# Altium project Dali-v01.PrjPcb
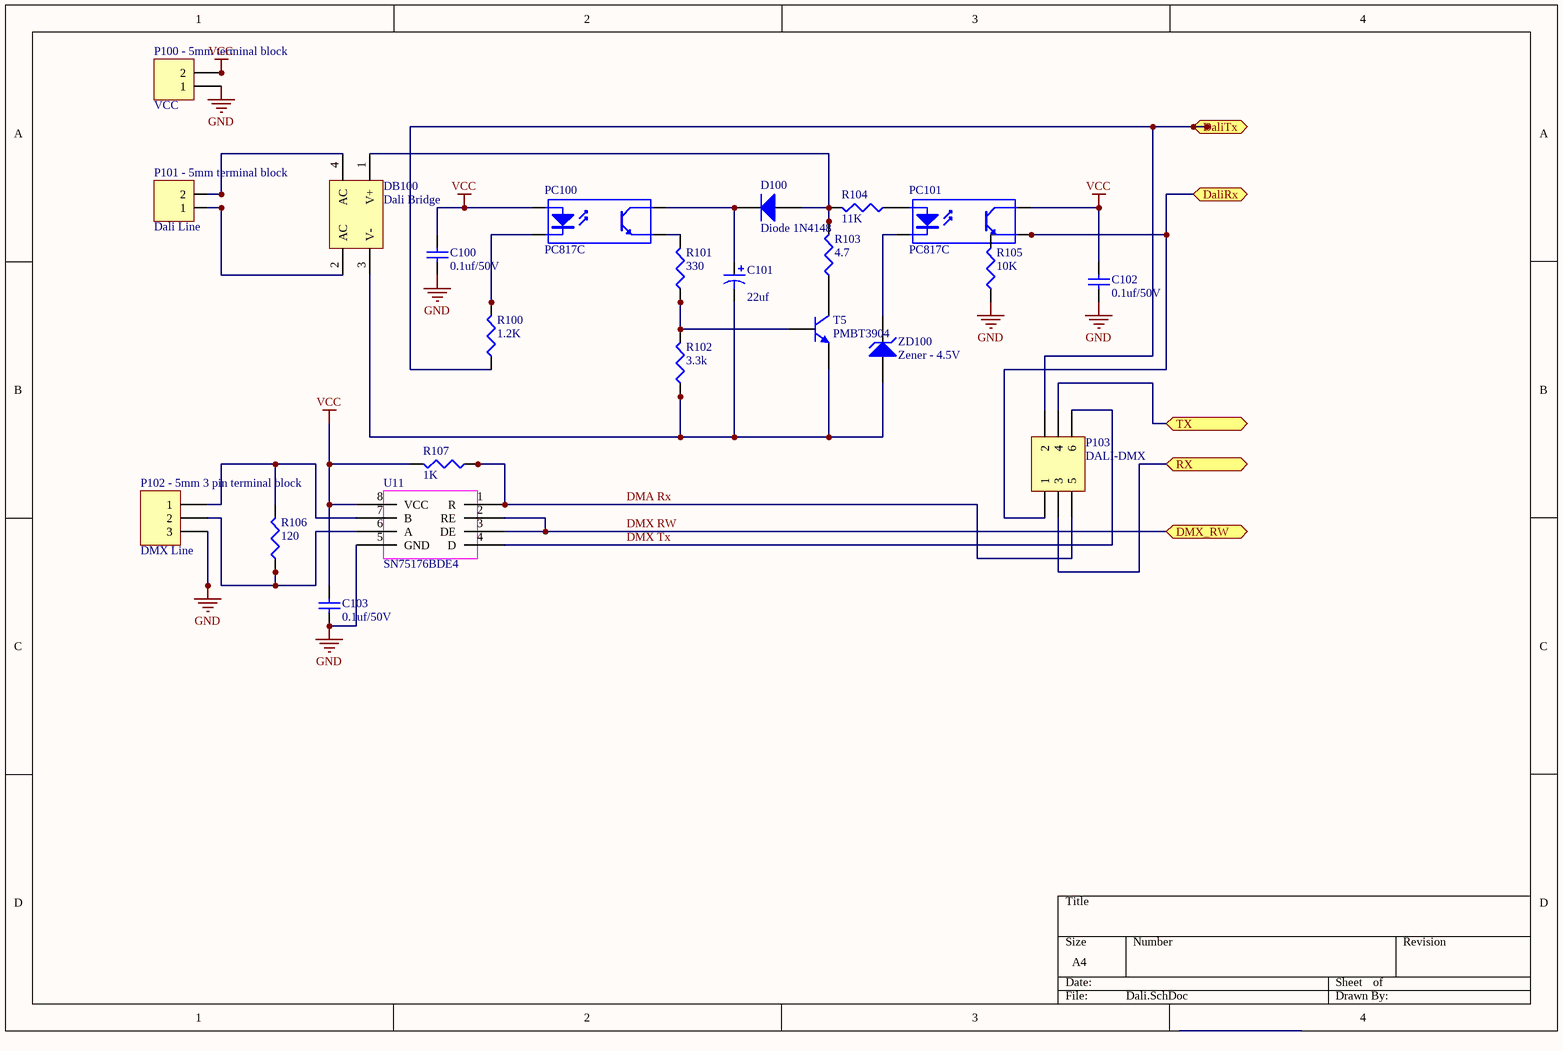
[diagram p0: Dali.SchDoc]
3 sheets, 82 parts. Net scope: flat (ports and power ports of the same name join across sheets).
Sheets:
  Dali.SchDoc
  Micro.SchDoc
  LEDDriver.SchDoc

## Sheet Dali.SchDoc
size A4

### Parts
C100  0.1uf/50V  [CC3225-1210]
C101  value 22uf  [CAPPR2.5-6.3x5]  (hidden comment: 22uf/16v)
C102  0.1uf/50V  [CC3225-1210]
C103  0.1uf/50V  [CC3225-1210]
D100  Diode 1N4148  [DO-35]
DB100  Dali Bridge  [SDIP]
P100_-_5mm_terminal_block  VCC  [HDR1X2]
P101_-_5mm_terminal_block  Dali Line  [HDR1X2]
P102_-_5mm_3_pin_terminal_block  DMX Line  [HDR1X3]
P103  DALI-DMX  [HDR2X3]
PC100  PC817C  [DIP-4]
PC101  PC817C  [DIP-4]
R100  value 1.2K  [CR2012-0805]  (hidden comment: CR2012-0805)
R101  value 330  [CR2012-0805]  (hidden comment: CR2012-0805)
R102  value 3.3k  [CR2012-0805]  (hidden comment: CR2012-0805)
R103  value 4.7  [CR2012-0805]  (hidden comment: CR2012-0805)
R104  value 11K  [CR2012-0805]  (hidden comment: CR2012-0805)
R105  value 10K  [CR2012-0805]  (hidden comment: CR2012-0805)
R106  value 120  [CR2012-0805]  (hidden comment: CR2012-0805)
R107  value 1K  [CR2012-0805]  (hidden comment: CR2012-0805)
T5  PMBT3904  [SOT23_N]
U11  SN75176BDE4  [8-SOIC (0.154", 3.90mm Width)]
ZD100  Zener - 4.5V  [DIODE-0.7]

### Ports
DaliRx, DaliTx, DMX_RW, RX, TX

### Nets
GND: C100.1 C102.1 C103.1 P100_-_5mm_terminal_block.1 P102_-_5mm_3_pin_terminal_block.3 R105.1 U11.5(GND)
VCC: C100.2 C102.2 C103.2 P100_-_5mm_terminal_block.2 PC100.1(A) PC101.4(C) R107.2 U11.8(VCC)
DMA Rx: P103.5 R107.1 U11.1(R)
DMX RW: U11.2(RE) U11.3(DE) ; port DMX_RW
DMX Tx: P103.6 U11.4(D)
NetC101_1: C101.1 D100.2(K) PC100.4(C)
NetC101_2: C101.2 DB100.3(V-) R102.1 T5.2(E) ZD100.1(A)
NetD100_1: D100.1(A) DB100.1(V+) R103.2 R104.2
NetDB100_2: DB100.2(AC) P101_-_5mm_terminal_block.1
NetDB100_4: DB100.4(AC) P101_-_5mm_terminal_block.2
NetP102_-_5mm_3_pin_terminal_block_1: P102_-_5mm_3_pin_terminal_block.1 R106.2 U11.7(B)
NetP102_-_5mm_3_pin_terminal_block_2: P102_-_5mm_3_pin_terminal_block.2 R106.1 U11.6(A)
NetP103_1: P103.1 PC101.3(E) R105.2 ; port DaliRx
NetP103_2: P103.2 R100.1 ; port DaliTx
NetP103_3: P103.3 ; port RX
NetP103_4: P103.4 ; port TX
NetPC100_2: PC100.2(K) R100.2
NetPC100_3: PC100.3(E) R101.2
NetPC101_1: PC101.1(A) R104.1
NetPC101_2: PC101.2(K) ZD100.2(K)
NetR101_1: R101.1 R102.2 T5.1(B)
NetR103_1: R103.1 T5.3(C)

### Library data of the parts
C100 C102 C103 = Cap: Capacitor; Value: 0.1uf; Published: 8-Jun-2000; LatestRevisionDate: 17-Jul-2002; LatestRevisionNote: Re-released for DXP Platform.; PackageReference: RAD-0.3; Publisher: Altium Limited; PackageDescription: Radial Cap, Thru-Hole; 2 Leads; 0.3 in Pin Spacing
C101 = Cap Pol1: Polarized Capacitor (Radial); Published: 8-Jun-2000; LatestRevisionDate: 17-Jul-2002; LatestRevisionNote: Re-released for DXP Platform.; PackageReference: RB7.6-15; Publisher: Altium Limited; PackageDescription: Polarized Capacitor (Radial); 2 Leads
D100 = Diode 1N4148: High Conductance Fast Diode; Published: 8-Jun-2000; LatestRevisionDate: 17-Jul-2002; LatestRevisionNote: Re-released for DXP Platform.; DatasheetVersion: 1997; PackageReference: DO-35; Publisher: Altium Limited; PackageDescription: Diode, Axial; Body 3.8 x 1.9 mm (LxDia. max), Lead Dia. 0.53 mm (max); Code_JEDEC: DO-204-AH; ComponentLink1Description: Manufacturer Link; ComponentLink1URL: http://www.fairchildsemi.com/; ComponentLink2Description: Datasheet; ComponentLink2URL: http://www.fairchildsemi.com/ds/1N%2F1N4148.pdf
DB100 = Bridge2: Diode Bridge; Published: 24-Mar-1999; LatestRevisionDate: 17-Jul-2002; LatestRevisionNote: Re-released for DXP Platform.; PackageReference: D-46_6A; Publisher: Altium Limited; PackageDescription: Bridge Rectifier; 4 Terminals; Body 16.8 x 16.8 mm (typ); Pitch 10.67 mm
P100_-_5mm_terminal_block P101_-_5mm_terminal_block = Header 2: Header, 2-Pin; LatestRevisionDate: 17-Jul-2002; LatestRevisionNote: Re-released for DXP Platform.; Publisher: Altium Limited
P102_-_5mm_3_pin_terminal_block = Header 3: Header, 3-Pin; LatestRevisionDate: 17-Jul-2002; LatestRevisionNote: Re-released for DXP Platform.; Publisher: Altium Limited
P103 = Header 3X2: Header, 3-Pin, Dual row; LatestRevisionDate: 17-Jul-2002; LatestRevisionNote: Re-released for DXP Platform.; Publisher: Altium Limited
PC100 PC101 = Optoisolator1: 4-Pin Phototransistor Optocoupler; Published: 24-Mar-1999; LatestRevisionDate: 04-Mar-2005; LatestRevisionNote: Sch pins 3 & 4 Swapped.; DatasheetVersion: Nov-2003; PackageReference: DIP-4; Publisher: Altium Limited
R100-R107 = Res3: Resistor; Published: 8-Jun-2000; LatestRevisionDate: 29-May-2009; LatestRevisionNote: IPC-7351 Footprint Added.; PackageReference: CR2012-0805; Publisher: Altium Limited; PackageDescription: Chip Resistor
T5 = PMBT3904: NPN Switching Transistor; Published: 17-Sep-2003; LatestRevisionDate: 12-Dec-2006; LatestRevisionNote: IPC-7351 Footprint Added.; DatasheetVersion: 27-Apr-1999; PackageVersion: May-1999; PackageReference: SOT23; Publisher: Altium Limited; PackageDescription: 3-Pin SOT-23 Package 0.95 mm Pitch, 2.3 mm Lead Span; ComponentLink1Description: Manufacturer Link; ComponentLink1URL: http://www.semiconductors.philips.com/; ComponentLink2Description: Datasheet; ComponentLink2URL: http://www.semiconductors.philips.com/acrobat/datasheets/PMBT3904_4.pdf
U11 = Component_1
ZD100 = D Zener: Zener Diode; Published: 8-Jun-2000; LatestRevisionDate: 17-Jul-2002; LatestRevisionNote: Re-released for DXP Platform.; PackageReference: DIODE-0.7; Publisher: Altium Limited; PackageDescription: Diode, Thru-Hole; 2 Leads; 0.7 in Pin Spacing

## Sheet Micro.SchDoc
size A4
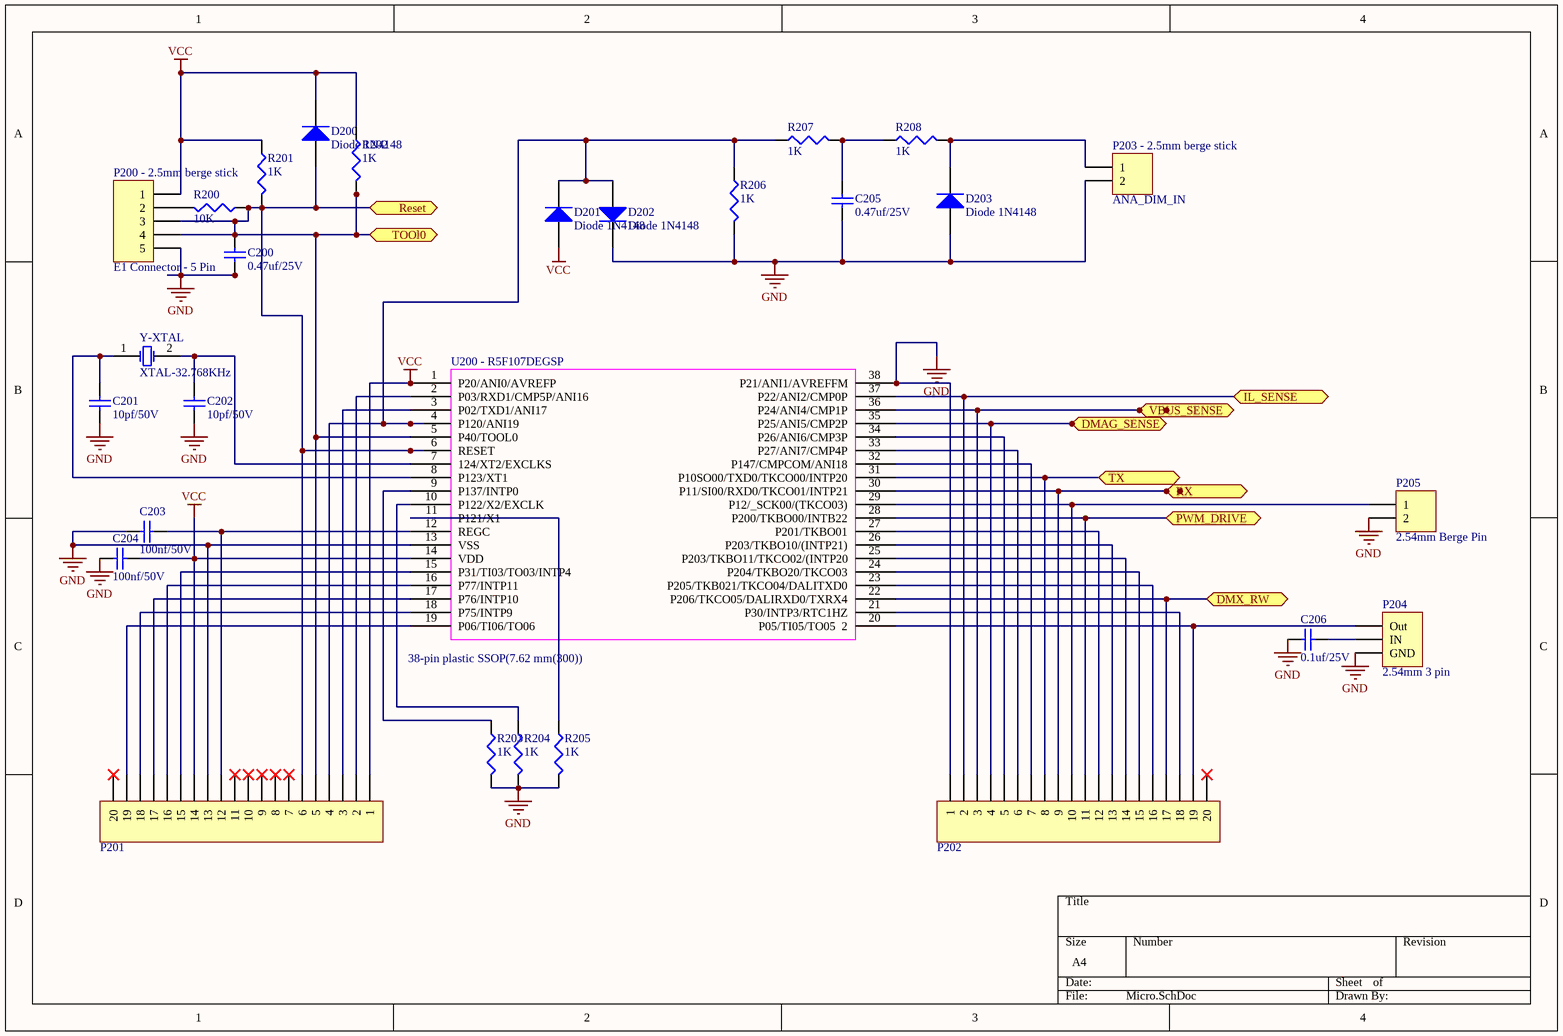
[diagram p1: Micro.SchDoc]

### Parts
C200  0.47uf/25V  [CC3225-1210]
C201  10pf/50V  [CC3225-1210]
C202  10pf/50V  [CC3225-1210]
C203  100nf/50V  [CC3225-1210]
C204  100nf/50V  [CC3225-1210]
C205  0.47uf/25V  [CC3225-1210]
C206  0.1uf/25V  [CC3225-1210]
D200  Diode 1N4148  [DO-35]
D201  Diode 1N4148  [DO-35]
D202  Diode 1N4148  [DO-35]
D203  Diode 1N4148  [DO-35]
P200_-_2.5mm_berge_stick  E1 Connector - 5 Pin  [HDR1X5]
P201  20 pin 2.5 mm berge stick  [HDR1X20]  (value not drawn)
P202  20 pin 2.5mm berge stick  [HDR1X20]  (value not drawn)
P203_-_2.5mm_berge_stick  ANA_DIM_IN  [HDR1X2]
P204  2.54mm 3 pin  [HDR1X3]
P205  2.54mm Berge Pin  [HDR1X2]
R200  value 10K  [CR2012-0805]  (hidden comment: CR2012-0805)
R201  value 1K  [CR2012-0805]  (hidden comment: CR2012-0805)
R202  value 1K  [CR2012-0805]  (hidden comment: CR2012-0805)
R203  value 1K  [CR2012-0805]  (hidden comment: CR2012-0805)
R204  value 1K  [CR2012-0805]  (hidden comment: CR2012-0805)
R205  value 1K  [CR2012-0805]  (hidden comment: CR2012-0805)
R206  value 1K  [CR2012-0805]  (hidden comment: CR2012-0805)
R207  value 1K  [CR2012-0805]  (hidden comment: CR2012-0805)
R208  value 1K  [CR2012-0805]  (hidden comment: CR2012-0805)
U200_-_R5F107DEGSP  38-pin plastic SSOP(7.62 mm(300))
Y-XTAL  XTAL-32.768KHz  [XI-11.1X4.68X3.51mm]

### Ports
DMAG_SENSE, DMX_RW, IL_SENSE, PWM_DRIVE, Reset, RX, TOOl0, TX, VBUS_SENSE

### Nets
GND: C200.1 C201.1 C202.1 C203.2 C204.2 C205.1 C206.2 D202.2(K) D203.1(A) P200_-_2.5mm_berge_stick.5 P201.13 P202.1 P203_-_2.5mm_berge_stick.2 P204.3(GND) P205.2 R203.2 R204.2 R205.2 R206.2 U200_-_R5F107DEGSP.13(VSS) U200_-_R5F107DEGSP.38(P21/ANI1/AVREFFM)
VCC: C204.1 D200.2(K) D201.1(A) P200_-_2.5mm_berge_stick.1 P201.1 P201.14 R201.1 R202.1 U200_-_R5F107DEGSP.1(P20/ANI0/AVREFP) U200_-_R5F107DEGSP.14(VDD)
DMX RW: P202.17 U200_-_R5F107DEGSP.22(P206/TKCO05/DALIRXD0/TXRX4) ; port DMX_RW
IL_SENSE: P202.2 U200_-_R5F107DEGSP.37(P22/ANI2/CMP0P) ; port IL_SENSE
NetC200_2: C200.2 D200.1(A) P200_-_2.5mm_berge_stick.3 P200_-_2.5mm_berge_stick.4 P201.5 P201.6 R200.1 R201.2 R202.2 U200_-_R5F107DEGSP.5(P40/TOOL0) U200_-_R5F107DEGSP.6(RESET) ; port Reset, port TOOl0
NetC201_2: C201.2 U200_-_R5F107DEGSP.8(P123/XT1) Y-XTAL.1(OSC1)
NetC202_2: C202.2 U200_-_R5F107DEGSP.7(124/XT2/EXCLKS) Y-XTAL.2(OSC2)
NetC203_1: C203.1 P201.12 U200_-_R5F107DEGSP.12(REGC)
NetC205_2: C205.2 R207.2 R208.1
NetC206_1: C206.1 P204.2(IN)
NetD201_2: D201.2(K) D202.1(A) P201.4 R206.1 R207.1 U200_-_R5F107DEGSP.4(P120/ANI19)
NetD203_2: D203.2(K) P203_-_2.5mm_berge_stick.1 R208.2
NetP103_3: P202.9 U200_-_R5F107DEGSP.30(P11/SI00/RXD0/TKCO01/INTP21) ; port RX
NetP103_4: P202.8 U200_-_R5F107DEGSP.31(P10SO00/TXD0/TKCO00/INTP20) ; port TX
NetP200_-_2.5mm_berge_stick_2: P200_-_2.5mm_berge_stick.2 R200.2
NetP201_2: P201.2 U200_-_R5F107DEGSP.2(P03/RXD1/CMP5P/ANI16)
NetP201_3: P201.3 U200_-_R5F107DEGSP.3(P02/TXD1/ANI17)
NetP201_15: P201.15 U200_-_R5F107DEGSP.15(P31/TI03/TO03/INTP4)
NetP201_16: P201.16 U200_-_R5F107DEGSP.16(P77/INTP11)
NetP201_17: P201.17 U200_-_R5F107DEGSP.17(P76/INTP10)
NetP201_18: P201.18 U200_-_R5F107DEGSP.18(P75/INTP9)
NetP201_19: P201.19 U200_-_R5F107DEGSP.19(P06/TI06/TO06)
NetP202_3: P202.3 U200_-_R5F107DEGSP.36(P24/ANI4/CMP1P) ; port VBUS_SENSE
NetP202_4: P202.4 U200_-_R5F107DEGSP.35(P25/ANI5/CMP2P) ; port DMAG_SENSE
NetP202_5: P202.5 U200_-_R5F107DEGSP.34(P26/ANI6/CMP3P)
NetP202_6: P202.6 U200_-_R5F107DEGSP.33(P27/ANI7/CMP4P)
NetP202_7: P202.7 U200_-_R5F107DEGSP.32(P147/CMPCOM/ANI18)
NetP202_10: P202.10 P205.1 U200_-_R5F107DEGSP.29(P12/_SCK00/(TKCO03))
NetP202_11: P202.11 U200_-_R5F107DEGSP.28(P200/TKBO00/INTB22) ; port PWM_DRIVE
NetP202_12: P202.12 U200_-_R5F107DEGSP.27(P201/TKBO01)
NetP202_13: P202.13 U200_-_R5F107DEGSP.26(P203/TKBO10/(INTP21))
NetP202_14: P202.14 U200_-_R5F107DEGSP.25(P203/TKBO11/TKCO02/(INTP20)
NetP202_15: P202.15 U200_-_R5F107DEGSP.24(P204/TKBO20/TKCO03)
NetP202_16: P202.16 U200_-_R5F107DEGSP.23(P205/TKB021/TKCO04/DALITXD0)
NetP202_18: P202.18 U200_-_R5F107DEGSP.21(P30/INTP3/RTC1HZ)
NetP202_19: P202.19 P204.1(Out) U200_-_R5F107DEGSP.20(P05/TI05/TO05__2)
NetR203_1: R203.1 U200_-_R5F107DEGSP.9(P137/INTP0)
NetR204_1: R204.1 U200_-_R5F107DEGSP.10(P122/X2/EXCLK)
NetR205_1: R205.1 U200_-_R5F107DEGSP.11(P121/X1)

Not connected (* = marked no-connect by the designer): P201 7* 8* 9* 10* 11* 20*; P202 20*

### Library data of the parts
C200 C205 = Cap: Capacitor; Value: 0.47uf; Published: 8-Jun-2000; LatestRevisionDate: 17-Jul-2002; LatestRevisionNote: Re-released for DXP Platform.; PackageReference: RAD-0.3; Publisher: Altium Limited; PackageDescription: Radial Cap, Thru-Hole; 2 Leads; 0.3 in Pin Spacing
C201 C202 = Cap: Capacitor; Value: 10pf; Published: 8-Jun-2000; LatestRevisionDate: 17-Jul-2002; LatestRevisionNote: Re-released for DXP Platform.; PackageReference: RAD-0.3; Publisher: Altium Limited; PackageDescription: Radial Cap, Thru-Hole; 2 Leads; 0.3 in Pin Spacing
C203 C204 = Cap: Capacitor; Value: 100nf; Published: 8-Jun-2000; LatestRevisionDate: 17-Jul-2002; LatestRevisionNote: Re-released for DXP Platform.; PackageReference: RAD-0.3; Publisher: Altium Limited; PackageDescription: Radial Cap, Thru-Hole; 2 Leads; 0.3 in Pin Spacing
C206 = Cap: Capacitor; Value: 0.1uf; Published: 8-Jun-2000; LatestRevisionDate: 17-Jul-2002; LatestRevisionNote: Re-released for DXP Platform.; PackageReference: RAD-0.3; Publisher: Altium Limited; PackageDescription: Radial Cap, Thru-Hole; 2 Leads; 0.3 in Pin Spacing
D200-D203 = Diode 1N4148: High Conductance Fast Diode; Published: 8-Jun-2000; LatestRevisionDate: 17-Jul-2002; LatestRevisionNote: Re-released for DXP Platform.; DatasheetVersion: 1997; PackageReference: DO-35; Publisher: Altium Limited; PackageDescription: Diode, Axial; Body 3.8 x 1.9 mm (LxDia. max), Lead Dia. 0.53 mm (max); Code_JEDEC: DO-204-AH; ComponentLink1Description: Manufacturer Link; ComponentLink1URL: http://www.fairchildsemi.com/; ComponentLink2Description: Datasheet; ComponentLink2URL: http://www.fairchildsemi.com/ds/1N%2F1N4148.pdf
P200_-_2.5mm_berge_stick = Header 5: Header, 5-Pin; LatestRevisionDate: 17-Jul-2002; LatestRevisionNote: Re-released for DXP Platform.; Publisher: Altium Limited
P201 P202 = Header 20: Header, 20-Pin; LatestRevisionDate: 17-Jul-2002; LatestRevisionNote: Re-released for DXP Platform.; Publisher: Altium Limited
P203_-_2.5mm_berge_stick P205 = Header 2: Header, 2-Pin; LatestRevisionDate: 17-Jul-2002; LatestRevisionNote: Re-released for DXP Platform.; Publisher: Altium Limited
P204 = Header 3: Header, 3-Pin; LatestRevisionDate: 17-Jul-2002; LatestRevisionNote: Re-released for DXP Platform.; Publisher: Altium Limited
R200-R208 = Res3: Resistor; Published: 8-Jun-2000; LatestRevisionDate: 29-May-2009; LatestRevisionNote: IPC-7351 Footprint Added.; PackageReference: CR2012-0805; Publisher: Altium Limited; PackageDescription: Chip Resistor
U200_-_R5F107DEGSP = Component_1: Package: 38-pin plastic SSOP(7.62 mm(300))
Y-XTAL = XTAL: Crystal Oscillator; Published: 8-Jun-2000; LatestRevisionDate: 17-Jul-2002; LatestRevisionNote: Re-released for DXP Platform.; PackageReference: R38; Publisher: Altium Limited; PackageDescription: Crystal, Thru-Hole; 2 Leads; Body 3.1 x 8.2 mm (Dia.xH)

## Sheet LEDDriver.SchDoc
size A4
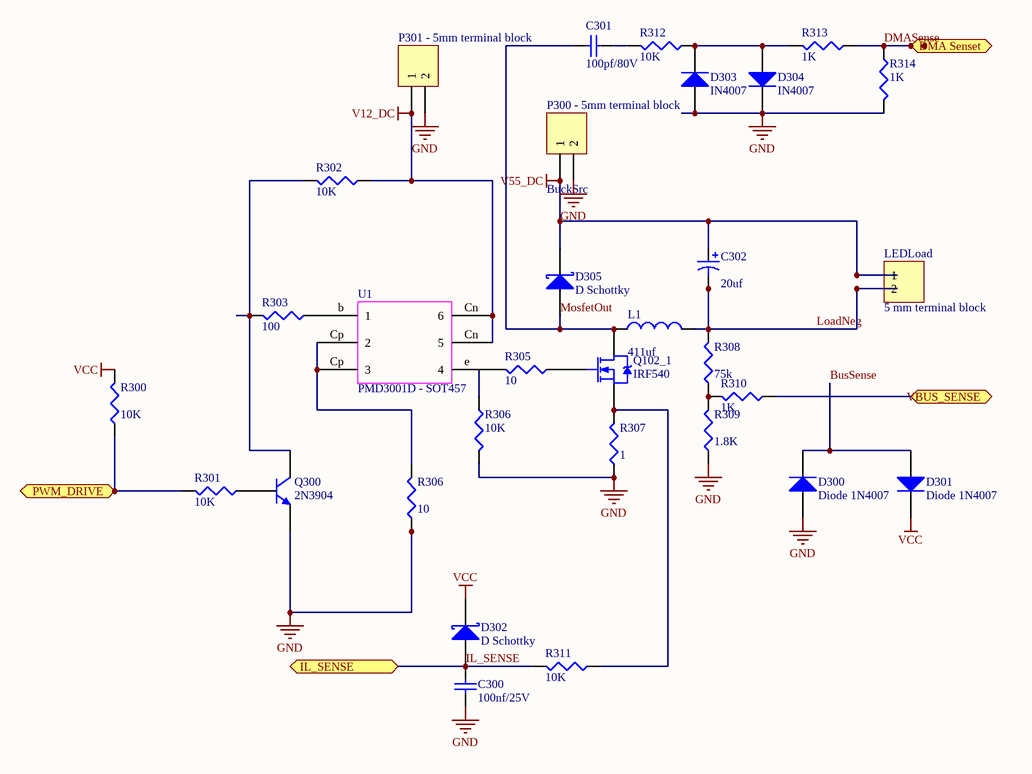
[diagram p2: LEDDriver.SchDoc]

### Parts
(Parts that share a designator on the sheet are numbered #1, #2 ... from top to bottom, then left to right.)
C300  100nf/25V  [CC3225-1210]
C301  100pf/80V  [CC3225-1210]
C302  value 20uf  [CAPPR2.5-6.3x5]  (hidden comment: 22uf/16v)
D300  Diode 1N4007  [DO-41]
D301  Diode 1N4007  [DO-41]
D302  D Schottky  [SMB]
D303  IN4007  [DO-41]
D304  IN4007  [DO-41]
D305  D Schottky  [SMB]
L1  value 411uf  [pitch 7mm]  (hidden comment: Inductor 411uH - pitch 7mm)
LEDLoad  5 mm terminal block  [HDR1X2]
P300_-_5mm_terminal_block  BuckSrc  [HDR1X2]
P301_-_5mm_terminal_block  (no value)  [HDR1X2]
Q102_1  IRF540  [TO-220AB]
Q300  2N3904  [TO-92A]
R300  value 10K  [CR3216-1206]  (hidden comment: CR3216-1206)
R301  value 10K  [CR3216-1206]  (hidden comment: CR3216-1206)
R302  value 10K  [CR3216-1206]  (hidden comment: CR3216-1206)
R303  value 100  [CR3216-1206]  (hidden comment: CR3216-1206)
R305  value 10  [CR3216-1206]  (hidden comment: CR3216-1206)
R306#1  value 10K  [CR3216-1206]  (hidden comment: CR3216-1206)
R306#2  value 10  [CR3216-1206]  (hidden comment: CR3216-1206)
R307  value 1  [CR3216-1206]  (hidden comment: CR3216-1206)
R308  value 75k  [CR3216-1206]  (hidden comment: CR3216-1206)
R309  value 1.8K  [CR3216-1206]  (hidden comment: CR3216-1206)
R310  value 1K  [CR3216-1206]  (hidden comment: CR3216-1206)
R311  value 10K  [CR3216-1206]  (hidden comment: 8-Jun-2000)
R312  value 10K  [CR3216-1206]  (hidden comment: 8-Jun-2000)
R313  value 1K  [CR3216-1206]  (hidden comment: 8-Jun-2000)
R314  value 1K  [CR3216-1206]  (hidden comment: 8-Jun-2000)
U1  PMD3001D - SOT457  [SOT 457]

### Ports
DMA Senset, IL_SENSE, PWM_DRIVE, VBUS_SENSE

### Nets
GND: C300.1 D300.1(A) D303.1(A) D304.2(K) P300_-_5mm_terminal_block.2 P301_-_5mm_terminal_block.2 Q300.1(E) R306#1.2 R306#2.1 R307.1 R309.1 R314.2
V12_DC: P301_-_5mm_terminal_block.1 R302.1 U1.Cn(6)
V55_DC: C302.1 D305.2(K) LEDLoad.1 P300_-_5mm_terminal_block.1
VCC: D301.2(K) D302.2(K) R300.2
BusSense: D300.2(K) D301.1(A)
DMASense: R313.1 R314.1 ; port DMA Senset
IL_SENSE: C300.2 D302.1(A) R311.2 ; port IL_SENSE
LoadNeg: C302.2 L1.2 LEDLoad.2 R308.2
MosfetOut: C301.2 D305.1(A) L1.1 Q102_1.2(D)
NetC301_1: C301.1 R312.2
NetD303_2: D303.2(K) D304.1(A) R312.1 R313.2
NetP202_3: R310.1 ; port VBUS_SENSE
NetP202_11: R300.1 R301.2 ; port PWM_DRIVE
NetQ102_1_1: Q102_1.1(G) R305.1
NetQ102_1_3: Q102_1.3(S) R307.2 R311.1
NetQ300_2: Q300.2(B) R301.1
NetQ300_3: Q300.3(C) R302.2 R303.2
NetR303_1: R303.1 U1.b(1)
NetR305_2: R305.2 U1.e(4)
NetR306#2_2: R306#2.2 U1.Cp(2)
NetR308_1: R308.1 R309.2 R310.2

Not connected (* = marked no-connect by the designer): R306#1 1

### Library data of the parts
C300 = Cap: Capacitor; Value: 100nf; Published: 8-Jun-2000; LatestRevisionDate: 17-Jul-2002; LatestRevisionNote: Re-released for DXP Platform.; PackageReference: RAD-0.3; Publisher: Altium Limited; PackageDescription: Radial Cap, Thru-Hole; 2 Leads; 0.3 in Pin Spacing
C301 = Cap: Capacitor; Value: 100pf; Published: 8-Jun-2000; LatestRevisionDate: 17-Jul-2002; LatestRevisionNote: Re-released for DXP Platform.; PackageReference: RAD-0.3; Publisher: Altium Limited; PackageDescription: Radial Cap, Thru-Hole; 2 Leads; 0.3 in Pin Spacing
C302 = Cap Pol1: Polarized Capacitor (Radial); Published: 8-Jun-2000; LatestRevisionDate: 17-Jul-2002; LatestRevisionNote: Re-released for DXP Platform.; PackageReference: RB7.6-15; Publisher: Altium Limited; PackageDescription: Polarized Capacitor (Radial); 2 Leads
D300 D301 D303 D304 = Diode 1N4007: 1 Amp General Purpose Rectifier; Published: 8-Jun-2000; LatestRevisionDate: 17-Jul-2002; LatestRevisionNote: Re-released for DXP Platform.; DatasheetVersion: 1998; PackageVersion: Aug-1999; PackageReference: DO-41; Publisher: Altium Limited; PackageDescription: Diode, Axial; Body 5.2 x 2.7 mm (LxDia. max), Lead Dia. 0.86 mm (max); Code_JEDEC: DO-204-AL; ComponentLink1Description: Manufacturer Link; ComponentLink1URL: http://www.fairchildsemi.com/; ComponentLink2Description: Datasheet; ComponentLink2URL: http://www.fairchildsemi.com/ds/1N%2F1N4001.pdf
D302 D305 = D Schottky: Schottky Diode; Published: 8-Jun-2000; LatestRevisionDate: 17-Jul-2002; LatestRevisionNote: Re-released for DXP Platform.; PackageReference: SMB; Publisher: Altium Limited; PackageDescription: DO-214-AA/SMB; 2 C-Bend Leads; Body 5.3 x 3.6 mm, inc. leads (LxW); Code_JEDEC: DO-214-AA
L1 = Inductor: Code_IEC: 1005; Published: 8-Jun-2000; LatestRevisionDate: 29-May-2009; LatestRevisionNote: IPC-7351 Footprint Added.; PackageReference: 0402-A; Publisher: Altium Limited; PackageDescription: Chip Inductor; Code_JEITA: 0402
LEDLoad P300_-_5mm_terminal_block P301_-_5mm_terminal_block = Header 2: Header, 2-Pin; LatestRevisionDate: 17-Jul-2002; LatestRevisionNote: Re-released for DXP Platform.; Publisher: Altium Limited
Q102_1 = IRF540: HEXFET N-Channel Power MOSFET; Note: Pin 2 is electrically connected to pin 4.; Published: 8-Jun-2000; LatestRevisionDate: 17-Jul-2002; LatestRevisionNote: Re-released for DXP Platform.; DatasheetVersion: PD-9.373H; PackageVersion: Feb-1997; PackageReference: TO-220AB; Publisher: Altium Limited; PackageDescription: TO, Thru-Hole, Vertical, Heatsink Mounted; 3 In-Line Leads; Pitch 2.54 mm; ComponentLink1Description: Manufacturer Link; ComponentLink1URL: http://www.irf.com/
Q300 = 2N3904: NPN General Purpose Amplifier; Published: 8-Jun-2000; LatestRevisionDate: 15-Jan-2003; LatestRevisionNote: PCB Footprint 'BCY-W3/D4.7' replaced; DatasheetVersion: 1997; PackageVersion: Sep-1998; PackageReference: TO-92A; Publisher: Altium Limited; PackageDescription: TO, Flat Index; 3 In-Line, Axial Leads; Body Dia. 4.5mm; Leads 0.51 x 0.48 mm (max); ComponentLink1Description: Manufacturer Link; ComponentLink1URL: http://www.fairchildsemi.com/; ComponentLink2Description: Datasheet; ComponentLink2URL: http://www.fairchildsemi.com/ds/2N%2F2N3904.pdf
R300-R303 R305 R306#1 R306#2 R307-R314 = Res3: Resistor; Published: 8-Jun-2000; LatestRevisionDate: 29-May-2009; LatestRevisionNote: IPC-7351 Footprint Added.; PackageReference: CR3216-1206; Publisher: Altium Limited; PackageDescription: Chip Resistor
U1 = Component_1

## Nets that join several sheets
GND: Dali (7 pins), Micro (21 pins), LEDDriver (12 pins)
VCC: Dali (8 pins), Micro (10 pins), LEDDriver (D301.2 D302.2 R300.2)
DMX RW: Dali (U11.2 U11.3), Micro (P202.17 U200_-_R5F107DEGSP.22)
IL_SENSE: Micro (P202.2 U200_-_R5F107DEGSP.37), LEDDriver (C300.2 D302.1 R311.2)
NetP103_3: Dali (P103.3), Micro (P202.9 U200_-_R5F107DEGSP.30)
NetP103_4: Dali (P103.4), Micro (P202.8 U200_-_R5F107DEGSP.31)
NetP202_3: Micro (P202.3 U200_-_R5F107DEGSP.36), LEDDriver (R310.1)
NetP202_11: Micro (P202.11 U200_-_R5F107DEGSP.28), LEDDriver (R300.1 R301.2)